# Altium schematic sheet fingerboard.SchDoc: Finger Board
size Letter; CheckedBy: 1; Author: Jianer Shi; DrawnBy: Jianer Shi; Engineer: Jianer Shi, Borui Chen; Revision: 1; CurrentDate: 9/20/2011; DocumentName: Finger Board; ModifiedDate: 9/20/2011; ProjectName: 3D Mouse
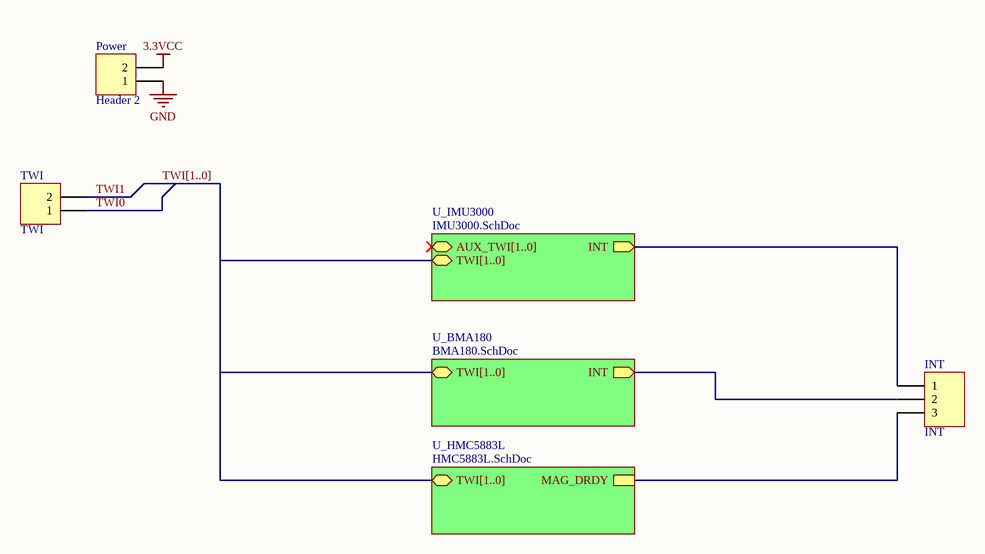
[diagram p0: fingerboard.SchDoc]

## Parts
INT  INT  [HDR1X3]
Power  Header 2  [HDR1X2]
TWI  TWI  [HDR1X2]

## Sub-sheets
U_BMA180 = BMA180.SchDoc: INT (out), TWI[1..0] (bidir)
U_HMC5883L = HMC5883L.SchDoc: TWI[1..0] (bidir), MAG_DRDY
U_IMU3000 = IMU3000.SchDoc: INT (out), AUX_TWI[1..0] (bidir), TWI[1..0] (bidir)

## Nets
3.3VCC: Power.2
GND: Power.1
TWI0: TWI.1
TWI1: TWI.2
NetINT_1: INT.1 ; sheet U_IMU3000/INT
NetINT_2: INT.2 ; sheet U_BMA180/INT
NetINT_3: INT.3 ; sheet U_HMC5883L/MAG_DRDY

## Buses and harness runs
bus TWI[1..0] = sheet U_BMA180/TWI[1..0] = sheet U_HMC5883L/TWI[1..0] = sheet U_IMU3000/TWI[1..0]

## Notes on the sheet
- Title
- Size:
- Date:
- Letter
- Number:
- Time:
- Revision:
- Sheet
- of
- File:

## Library data of the parts
INT = Header 3: Header, 3-Pin; LatestRevisionDate: 17-Jul-2002; LatestRevisionNote: Re-released for DXP Platform.; Publisher: Altium Limited
Power TWI = Header 2: Header, 2-Pin; LatestRevisionDate: 17-Jul-2002; LatestRevisionNote: Re-released for DXP Platform.; Publisher: Altium Limited